# Altium schematic sheet tx_mini_buck.SchDoc
size A4
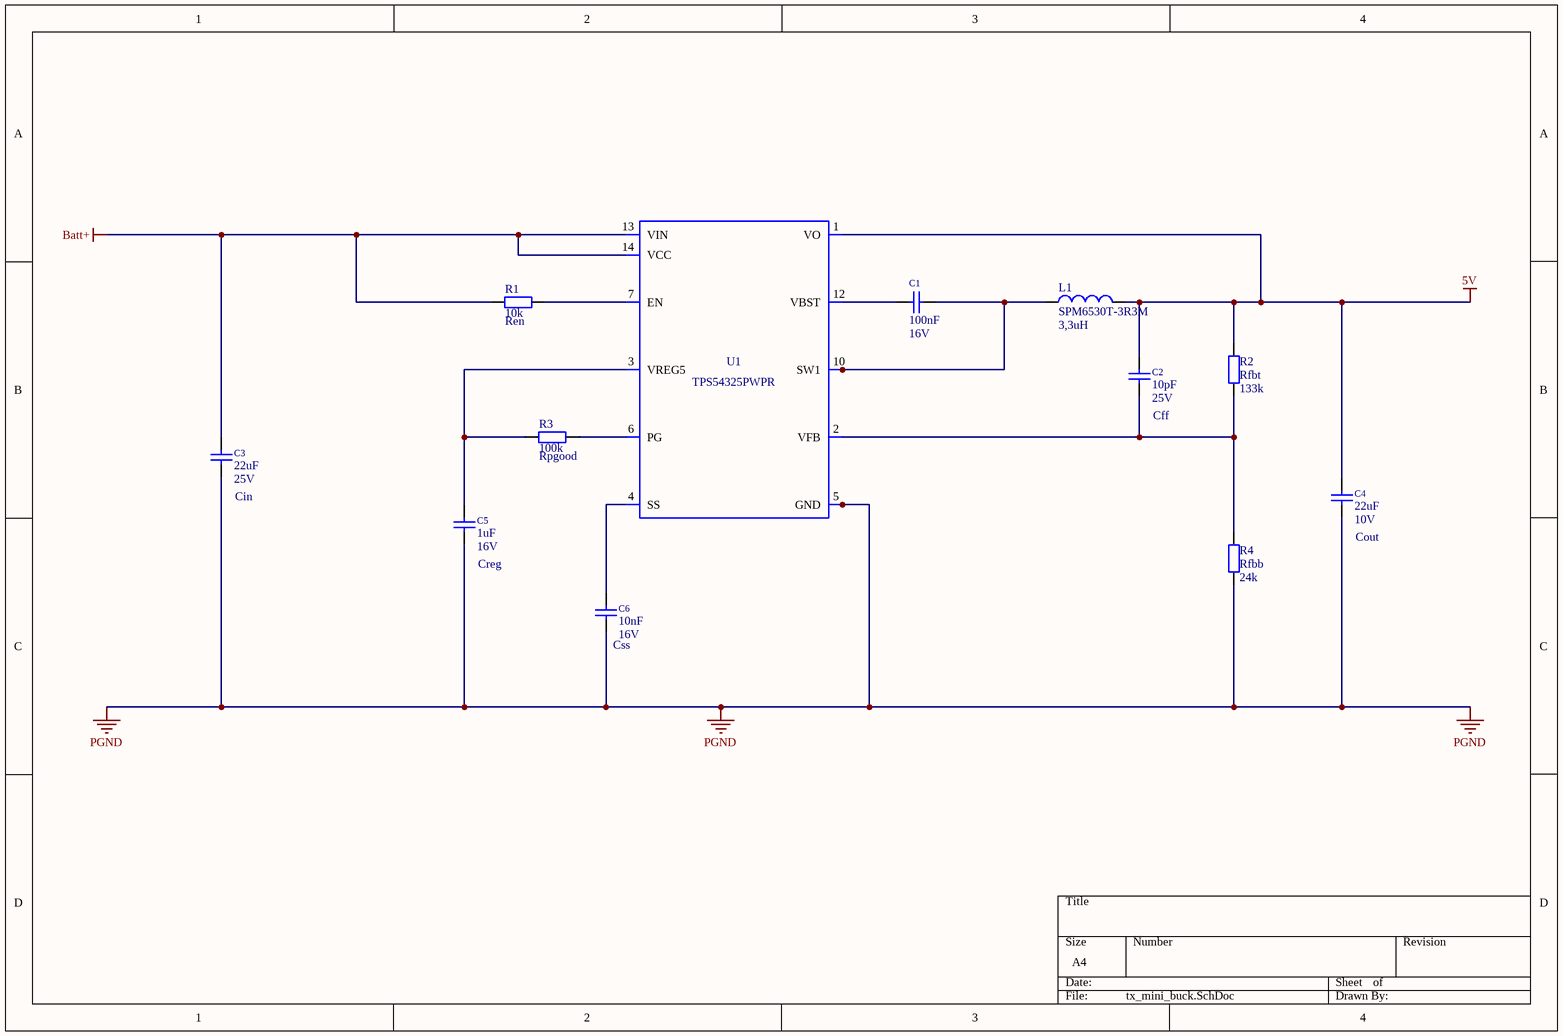
[diagram p0: tx_mini_buck.SchDoc]

## Parts
C1  Voltage: 16V  [C0402]  (hidden comment: 100nF)
C2  Voltage: 25V  Bezeichnung: Cff  [C0402]  (hidden comment: 10pF)
C3  Voltage: 25V  Bezeichnung: Cin  [C1210]  (hidden comment: 22uF)
C4  Voltage: 10V  Bezeichnung: Cout  [C1206]  (hidden comment: 22uF)
C5  Voltage: 16V  Bezeichnung: Creg  [C0603]  (hidden comment: 1uF)
C6  Voltage: 16V  Bezeichnung: Css  [C0402]  (hidden comment: 10nF)
L1  Herst.Bez.:: SPM6530T-3R3M  Inductance: 3,3uH  [SPM6530]  (hidden comment: Inductance)
R1  value 10k  Bezeichnung: Ren  [RES0402]  (hidden comment: R)
R2  value 133k  Bezeichnung: Rfbt  [RES0402]  (hidden comment: R)
R3  value 100k  Bezeichnung: Rpgood  [RES0402]  (hidden comment: R)
R4  value 24k  Bezeichnung: Rfbb  [RES0603]  (hidden comment: R)
U1  TPS54225PWP  [R-PDSO-G14]  (value not drawn)

## Nets
5V: C2.1 C4.1 L1.2 R2.2 U1.1(VO)
Batt+: C3.1 R1.1 U1.13(VIN) U1.14(VCC)
PGND: C3.2 C4.2 C5.2 C6.2 R4.1 U1.5(GND) U1.8(PGND1) U1.9(PGND2) U1.15(ETPAD)
NetC1_1: C1.1 U1.12(VBST)
NetC1_2: C1.2 L1.1 U1.10(SW1) U1.11(SW2)
NetC2_2: C2.2 R2.1 R4.2 U1.2(VFB)
NetC5_1: C5.1 R3.1 U1.3(VREG5)
NetC6_1: C6.1 U1.4(SS)
NetR1_2: R1.2 U1.7(EN)
NetR3_2: R3.2 U1.6(PG)

## Library data of the parts
C1 = C 100nF 0402: Capacitor; Best.Nr.:: *; Herst.Bez.:: *; Distributor: *; Value: 100nF
C2 = C: Capacitor; Herst.Bez.:: GRM1555C1E100JA01D; Best.Nr.:: *; Distributor: *; Value: 10pF
C3 = C: Capacitor; Herst.Bez.:: GRM32ER61E226KE15L; Best.Nr.:: *; Distributor: *; Value: 22uF
C4-C6 = C: Capacitor; Best.Nr.:: *; Herst.Bez.:: *; Distributor: *
  C4: Value: 22uF
  C5: Value: 1uF
  C6: Value: 10nF
L1 = L power: Power Inductance; Vendor: *; Best.Nr.:: *; Datenblatt: *; Distributor: *; Bezeichnung: *; Mounted: *
R1 R3 = R: Resistor; Best.Nr.:: *; Datenblatt: *; Distributor: *
R2 = R: Resistor; Herst.Bez.:: CRCW0402133KFKED; Best.Nr.:: *; Datenblatt: *; Distributor: *
R4 = R: Resistor; Herst.Bez.:: RC0603FR-0724KL; Best.Nr.:: *; Datenblatt: *; Distributor: *
U1 = TPS54225PWP: TPS54325PWPR; Manufacturer Name: Texas Instruments; Value: UNLISTED; PackageReference: TPS54325PWPR; Manufacturer Part Number: TPS54225PWP